# Altium schematic sheet DIOT_Kasli_Adapter.SchDoc
size 420 x 297 mm; DocumentNumber: 1; SheetNumber: 1; SheetTotal: 8; EDA_Number: ARTIQ; ModifiedBy: -; Title2: -; DivGrp: ISE; ModifiedDate: -
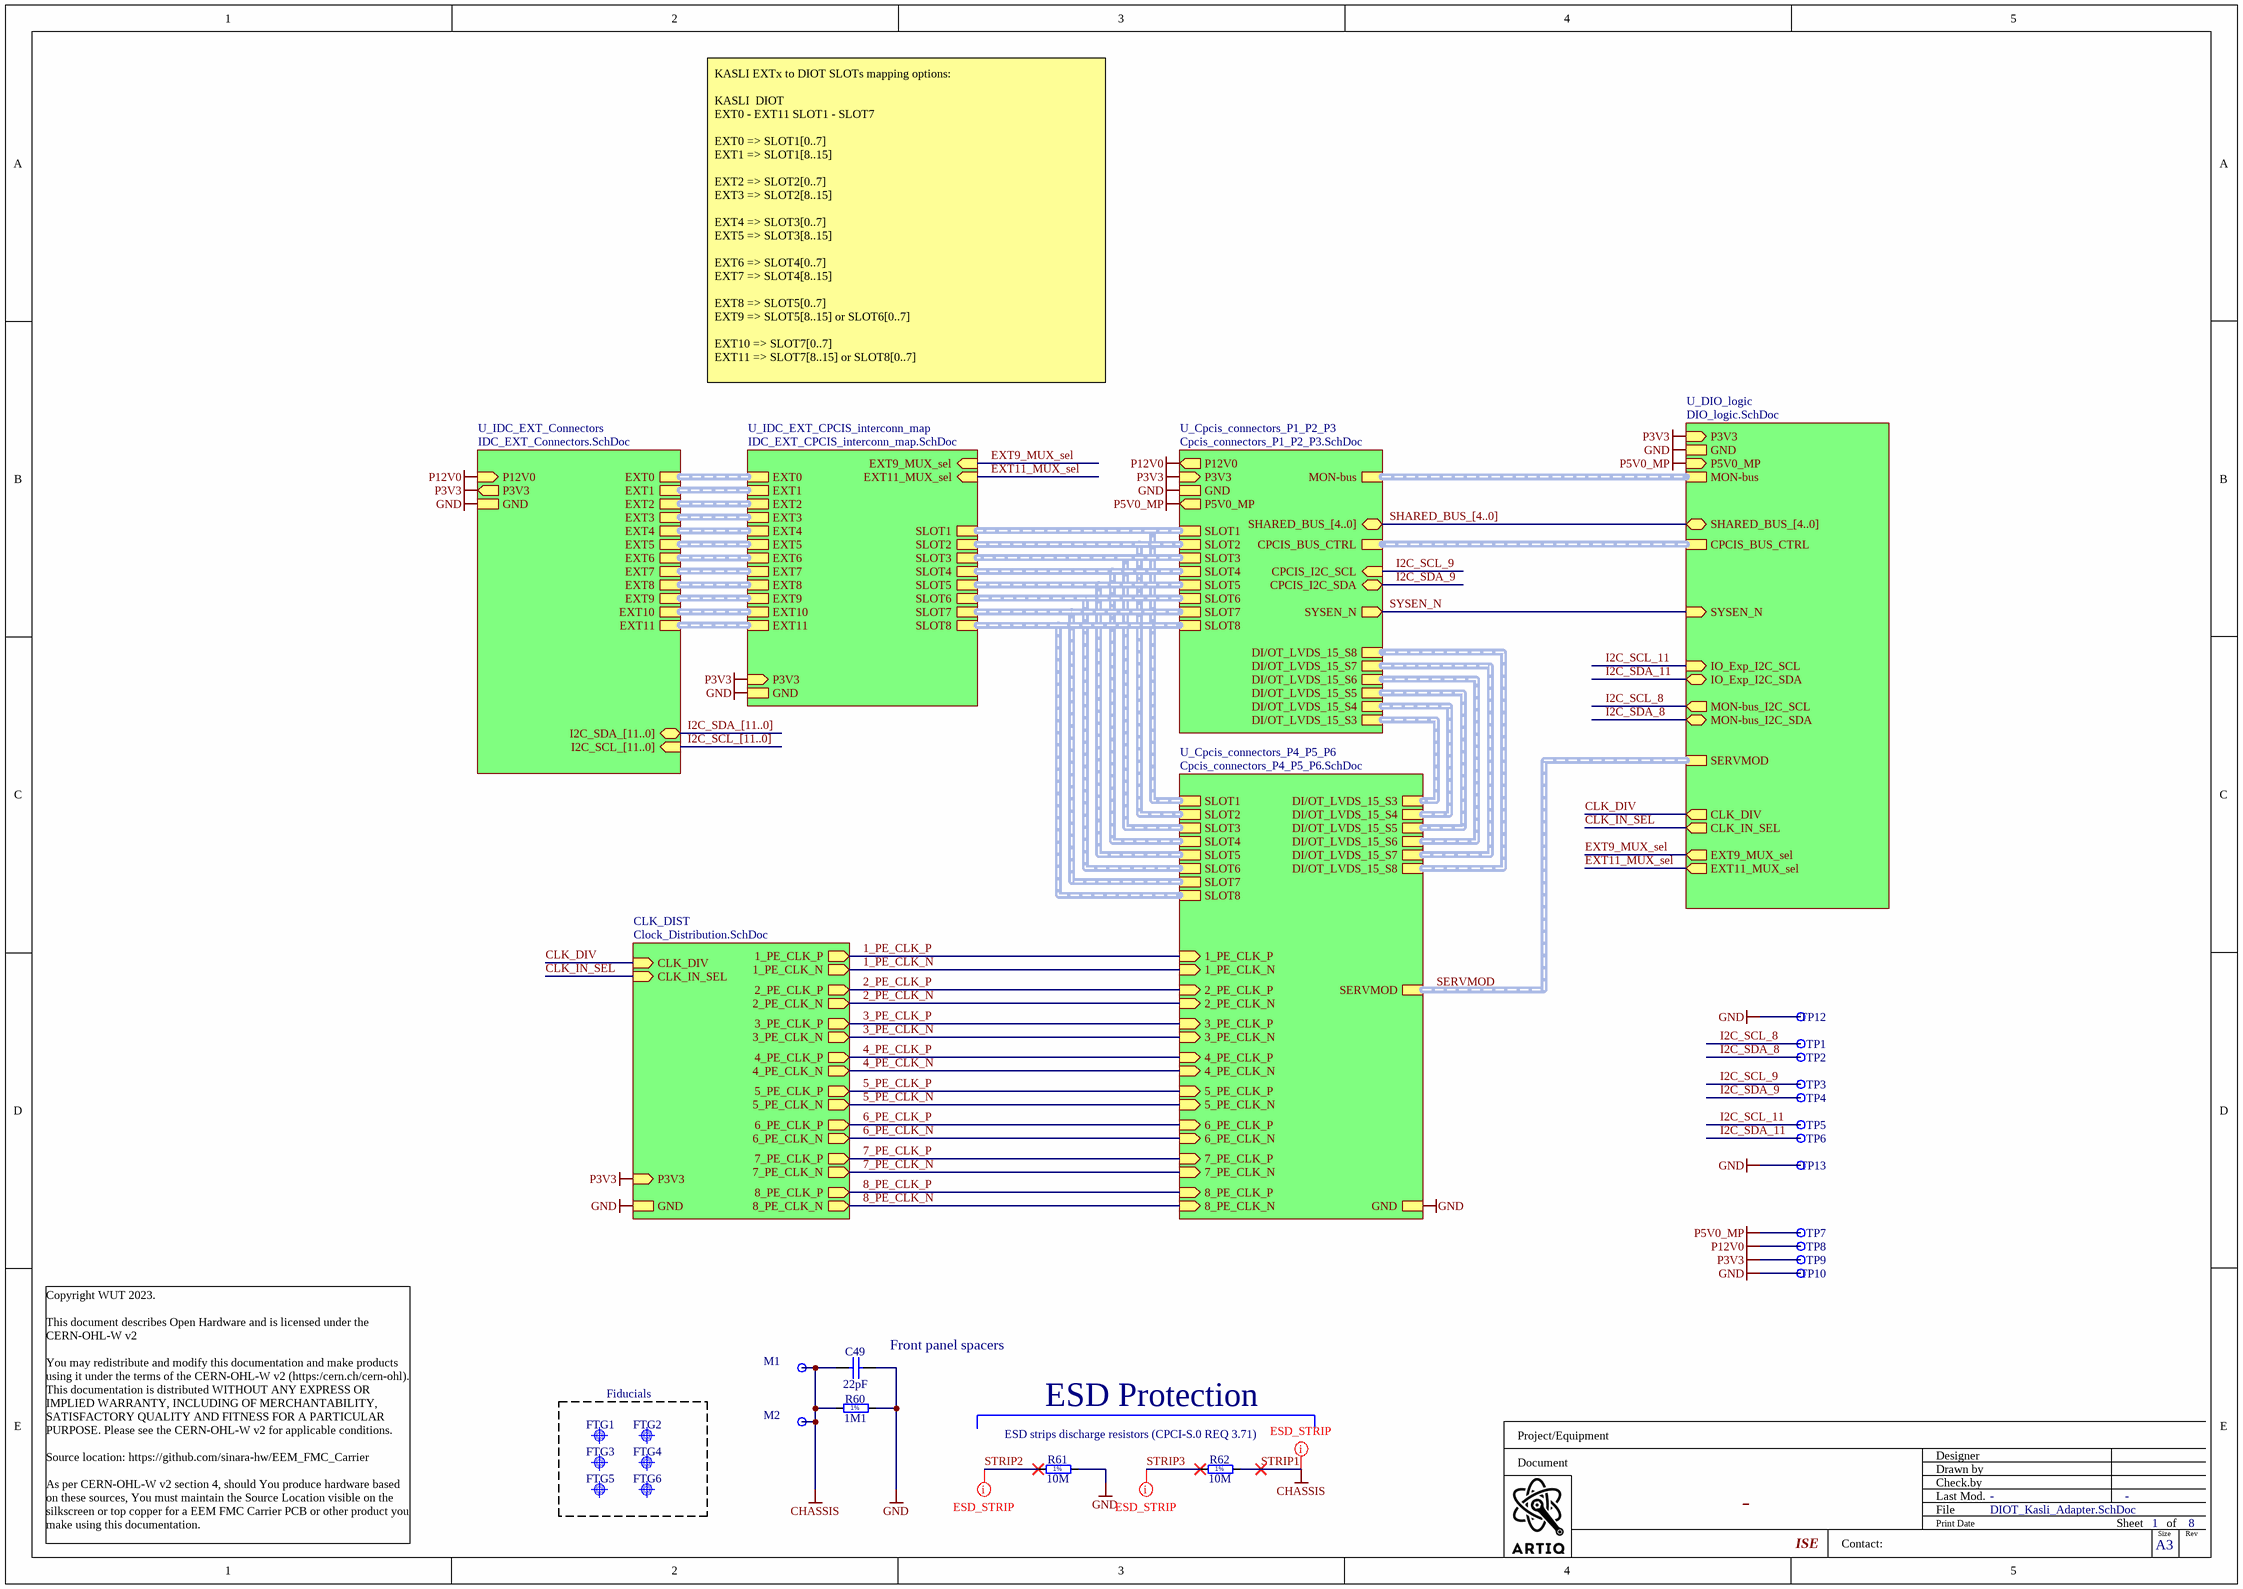
[diagram p0: DIOT_Kasli_Adapter.SchDoc]

## Parts
C49  22pF  [CAPC1005X55N]
FTG1  Use only in PCB  [FIDUCIAL_TOP_S100-200]  (value not drawn)  (no BOM)
FTG2  Use only in PCB  [FIDUCIAL_TOP_S100-200]  (value not drawn)  (no BOM)
FTG3  Use only in PCB  [FIDUCIAL_TOP_S100-200]  (value not drawn)  (no BOM)
FTG4  Use only in PCB  [FIDUCIAL_TOP_S100-200]  (value not drawn)  (no BOM)
FTG5  Use only in PCB  [FIDUCIAL_TOP_S100-200]  (value not drawn)  (no BOM)
FTG6  Use only in PCB  [FIDUCIAL_TOP_S100-200]  (value not drawn)  (no BOM)
M1  Plated Hole  [MTG300_600]  (value not drawn)  (no BOM)
M2  Plated Hole  [MTG300_600]  (value not drawn)  (no BOM)
R60  1M1  [RESC2012X60N]
R61  10M  [RESC2113X55N]
R62  10M  [RESC2113X55N]
TP1  P3V3  [TPS127]  (value not drawn)  (no BOM)
TP2  P3V3  [TPS127]  (value not drawn)  (no BOM)
TP3  P3V3  [TPS127]  (value not drawn)  (no BOM)
TP4  P3V3  [TPS127]  (value not drawn)  (no BOM)
TP5  P3V3  [TPS127]  (value not drawn)  (no BOM)
TP6  P3V3  [TPS127]  (value not drawn)  (no BOM)
TP7  P3V3  [TPS127]  (value not drawn)  (no BOM)
TP8  P3V3  [TPS127]  (value not drawn)  (no BOM)
TP9  P3V3  [TPS127]  (value not drawn)  (no BOM)
TP10  P3V3  [TPS127]  (value not drawn)  (no BOM)
TP12  P3V3  [TPS127]  (value not drawn)  (no BOM)
TP13  P3V3  [TPS127]  (value not drawn)  (no BOM)

## Blocks framed on the sheet
Fiducials: FTG1-FTG6

## Sub-sheets
CLK_DIST = Clock_Distribution.SchDoc: 1_PE_CLK_P (out), 1_PE_CLK_N (out), 2_PE_CLK_P (out), 2_PE_CLK_N (out), 3_PE_CLK_P (out), 3_PE_CLK_N (out), 4_PE_CLK_P (out), 4_PE_CLK_N (out), 5_PE_CLK_P (out), 5_PE_CLK_N (out), 6_PE_CLK_P (out), 6_PE_CLK_N (out), 7_PE_CLK_P (out), 7_PE_CLK_N (out), 8_PE_CLK_P (out), 8_PE_CLK_N (out), CLK_DIV (in), CLK_IN_SEL (in), P3V3 (in), GND
U_Cpcis_connectors_P1_P2_P3 = Cpcis_connectors_P1_P2_P3.SchDoc: CPCIS_I2C_SCL (in), CPCIS_I2C_SDA (bidir), SLOT7 (harness SLOT), SLOT6 (harness ExtensionConnector), SLOT1 (harness SLOT), SLOT5 (harness SLOT), SLOT2 (harness SLOT), SLOT3 (harness SLOT), SLOT4 (harness SLOT), SLOT8 (harness ExtensionConnector), DI/OT_LVDS_15_S3 (harness LVDS), DI/OT_LVDS_15_S4 (harness LVDS), DI/OT_LVDS_15_S5 (harness LVDS), DI/OT_LVDS_15_S6 (harness LVDS), DI/OT_LVDS_15_S7 (harness LVDS), DI/OT_LVDS_15_S8 (harness LVDS), SHARED_BUS_[4..0] (bidir), GND, P12V0 (out), CPCIS_BUS_CTRL (harness CPCIS_BUS_CTRL), P3V3 (in), SYSEN_N (out), MON-bus (harness MON-bus), P5V0_MP (out)
U_Cpcis_connectors_P4_P5_P6 = Cpcis_connectors_P4_P5_P6.SchDoc: 1_PE_CLK_P (in), 1_PE_CLK_N (in), 2_PE_CLK_P (in), 2_PE_CLK_N (in), 3_PE_CLK_P (in), 3_PE_CLK_N (in), 4_PE_CLK_P (in), 4_PE_CLK_N (in), 5_PE_CLK_P (in), 5_PE_CLK_N (in), 6_PE_CLK_P (in), 6_PE_CLK_N (in), 7_PE_CLK_P (in), 7_PE_CLK_N (in), 8_PE_CLK_P (in), 8_PE_CLK_N (in), SLOT8 (harness ExtensionConnector), SLOT5 (harness SLOT), SLOT1 (harness SLOT), SLOT3 (harness SLOT), SLOT6 (harness ExtensionConnector), SLOT2 (harness SLOT), SLOT7 (harness SLOT), SLOT4 (harness SLOT), DI/OT_LVDS_15_S3 (harness LVDS), DI/OT_LVDS_15_S4 (harness LVDS), DI/OT_LVDS_15_S5 (harness LVDS), DI/OT_LVDS_15_S6 (harness LVDS), DI/OT_LVDS_15_S7 (harness LVDS), DI/OT_LVDS_15_S8 (harness LVDS), SERVMOD (harness SERVMOD), GND
U_DIO_logic = DIO_logic.SchDoc: CPCIS_BUS_CTRL (harness CPCIS_BUS_CTRL), MON-bus (harness MON-bus), GND, P3V3 (in), SYSEN_N (in), SERVMOD (harness SERVMOD), SHARED_BUS_[4..0] (bidir), IO_Exp_I2C_SCL (in), IO_Exp_I2C_SDA (bidir), P5V0_MP (in), MON-bus_I2C_SCL (out), MON-bus_I2C_SDA (bidir), CLK_DIV (out), CLK_IN_SEL (out), EXT9_MUX_sel (out), EXT11_MUX_sel (out)
U_IDC_EXT_Connectors = IDC_EXT_Connectors.SchDoc: EXT0 (harness ExtensionConnector), EXT2 (harness ExtensionConnector), EXT4 (harness ExtensionConnector), EXT5 (harness ExtensionConnector), EXT6 (harness ExtensionConnector), EXT7 (harness ExtensionConnector), I2C_SDA_[11..0] (bidir), I2C_SCL_[11..0] (in), EXT3 (harness ExtensionConnector), EXT1 (harness ExtensionConnector), EXT8 (harness ExtensionConnector), EXT9 (harness ExtensionConnector), EXT10 (harness ExtensionConnector), EXT11 (harness ExtensionConnector), GND, P3V3 (out), P12V0 (in)
U_IDC_EXT_CPCIS_interconn_map = IDC_EXT_CPCIS_interconn_map.SchDoc: EXT0 (harness ExtensionConnector), EXT2 (harness ExtensionConnector), EXT4 (harness ExtensionConnector), EXT5 (harness ExtensionConnector), EXT6 (harness ExtensionConnector), EXT7 (harness ExtensionConnector), EXT3 (harness ExtensionConnector), EXT1 (harness ExtensionConnector), EXT8 (harness ExtensionConnector), EXT9 (harness ExtensionConnector), EXT10 (harness ExtensionConnector), EXT11 (harness ExtensionConnector), SLOT2 (harness SLOT), SLOT3 (harness SLOT), SLOT1 (harness SLOT), SLOT4 (harness SLOT), SLOT5 (harness SLOT), SLOT6 (harness ExtensionConnector), SLOT8 (harness ExtensionConnector), SLOT7 (harness SLOT), GND, P3V3 (in), EXT9_MUX_sel (in), EXT11_MUX_sel (in)

## Nets
GND: C49.2 R60.2 R61.2 TP10.1 TP12.1 TP13.1 ; sheet U_Cpcis_connectors_P1_P2_P3/GND, sheet U_Cpcis_connectors_P4_P5_P6/GND, sheet U_IDC_EXT_Connectors/GND, sheet CLK_DIST/GND, sheet U_IDC_EXT_CPCIS_interconn_map/GND, sheet U_DIO_logic/GND
P3V3: TP9.1 ; sheet U_Cpcis_connectors_P1_P2_P3/P3V3, sheet U_IDC_EXT_Connectors/P3V3, sheet CLK_DIST/P3V3, sheet U_IDC_EXT_CPCIS_interconn_map/P3V3, sheet U_DIO_logic/P3V3
P5V0_MP: TP7.1 ; sheet U_Cpcis_connectors_P1_P2_P3/P5V0_MP, sheet U_DIO_logic/P5V0_MP
P12V0: TP8.1 ; sheet U_Cpcis_connectors_P1_P2_P3/P12V0, sheet U_IDC_EXT_Connectors/P12V0
STRIP1: C49.1 M1.1 M2.1 R60.1 R62.2  [also labelled CHASSIS]
1_PE_CLK_N: sheet U_Cpcis_connectors_P4_P5_P6/1_PE_CLK_N, sheet CLK_DIST/1_PE_CLK_N
1_PE_CLK_P: sheet U_Cpcis_connectors_P4_P5_P6/1_PE_CLK_P, sheet CLK_DIST/1_PE_CLK_P
2_PE_CLK_N: sheet U_Cpcis_connectors_P4_P5_P6/2_PE_CLK_N, sheet CLK_DIST/2_PE_CLK_N
2_PE_CLK_P: sheet U_Cpcis_connectors_P4_P5_P6/2_PE_CLK_P, sheet CLK_DIST/2_PE_CLK_P
3_PE_CLK_N: sheet U_Cpcis_connectors_P4_P5_P6/3_PE_CLK_N, sheet CLK_DIST/3_PE_CLK_N
3_PE_CLK_P: sheet U_Cpcis_connectors_P4_P5_P6/3_PE_CLK_P, sheet CLK_DIST/3_PE_CLK_P
4_PE_CLK_N: sheet U_Cpcis_connectors_P4_P5_P6/4_PE_CLK_N, sheet CLK_DIST/4_PE_CLK_N
4_PE_CLK_P: sheet U_Cpcis_connectors_P4_P5_P6/4_PE_CLK_P, sheet CLK_DIST/4_PE_CLK_P
5_PE_CLK_N: sheet U_Cpcis_connectors_P4_P5_P6/5_PE_CLK_N, sheet CLK_DIST/5_PE_CLK_N
5_PE_CLK_P: sheet U_Cpcis_connectors_P4_P5_P6/5_PE_CLK_P, sheet CLK_DIST/5_PE_CLK_P
6_PE_CLK_N: sheet U_Cpcis_connectors_P4_P5_P6/6_PE_CLK_N, sheet CLK_DIST/6_PE_CLK_N
6_PE_CLK_P: sheet U_Cpcis_connectors_P4_P5_P6/6_PE_CLK_P, sheet CLK_DIST/6_PE_CLK_P
7_PE_CLK_N: sheet U_Cpcis_connectors_P4_P5_P6/7_PE_CLK_N, sheet CLK_DIST/7_PE_CLK_N
7_PE_CLK_P: sheet U_Cpcis_connectors_P4_P5_P6/7_PE_CLK_P, sheet CLK_DIST/7_PE_CLK_P
8_PE_CLK_N: sheet U_Cpcis_connectors_P4_P5_P6/8_PE_CLK_N, sheet CLK_DIST/8_PE_CLK_N
8_PE_CLK_P: sheet U_Cpcis_connectors_P4_P5_P6/8_PE_CLK_P, sheet CLK_DIST/8_PE_CLK_P
CLK_DIV: sheet CLK_DIST/CLK_DIV, sheet U_DIO_logic/CLK_DIV
CLK_IN_SEL: sheet CLK_DIST/CLK_IN_SEL, sheet U_DIO_logic/CLK_IN_SEL
EXT9_MUX_sel: sheet U_IDC_EXT_CPCIS_interconn_map/EXT9_MUX_sel, sheet U_DIO_logic/EXT9_MUX_sel
EXT11_MUX_sel: sheet U_IDC_EXT_CPCIS_interconn_map/EXT11_MUX_sel, sheet U_DIO_logic/EXT11_MUX_sel
I2C_SCL_8: TP1.1 ; sheet U_DIO_logic/MON-bus_I2C_SCL
I2C_SCL_9: TP3.1 ; sheet U_Cpcis_connectors_P1_P2_P3/CPCIS_I2C_SCL
I2C_SCL_11: TP5.1 ; sheet U_DIO_logic/IO_Exp_I2C_SCL
I2C_SDA_8: TP2.1 ; sheet U_DIO_logic/MON-bus_I2C_SDA
I2C_SDA_9: TP4.1 ; sheet U_Cpcis_connectors_P1_P2_P3/CPCIS_I2C_SDA
I2C_SDA_11: TP6.1 ; sheet U_DIO_logic/IO_Exp_I2C_SDA
STRIP2: R61.1
STRIP3: R62.1
SYSEN_N: sheet U_Cpcis_connectors_P1_P2_P3/SYSEN_N, sheet U_DIO_logic/SYSEN_N

## Buses and harness runs
bus I2C_SCL_[11..0] = sheet U_IDC_EXT_Connectors/I2C_SCL_[11..0]
bus I2C_SDA_[11..0] = sheet U_IDC_EXT_Connectors/I2C_SDA_[11..0]
bus SHARED_BUS_[4..0] = sheet U_Cpcis_connectors_P1_P2_P3/SHARED_BUS_[4..0] = sheet U_DIO_logic/SHARED_BUS_[4..0]
harness SERVMOD = sheet U_Cpcis_connectors_P4_P5_P6/SERVMOD = sheet U_DIO_logic/SERVMOD
harness sheet U_Cpcis_connectors_P1_P2_P3/CPCIS_BUS_CTRL = sheet U_DIO_logic/CPCIS_BUS_CTRL
harness sheet U_Cpcis_connectors_P1_P2_P3/DI/OT_LVDS_15_S3 = sheet U_Cpcis_connectors_P4_P5_P6/DI/OT_LVDS_15_S3
harness sheet U_Cpcis_connectors_P1_P2_P3/DI/OT_LVDS_15_S4 = sheet U_Cpcis_connectors_P4_P5_P6/DI/OT_LVDS_15_S4
harness sheet U_Cpcis_connectors_P1_P2_P3/DI/OT_LVDS_15_S5 = sheet U_Cpcis_connectors_P4_P5_P6/DI/OT_LVDS_15_S5
harness sheet U_Cpcis_connectors_P1_P2_P3/DI/OT_LVDS_15_S6 = sheet U_Cpcis_connectors_P4_P5_P6/DI/OT_LVDS_15_S6
harness sheet U_Cpcis_connectors_P1_P2_P3/DI/OT_LVDS_15_S7 = sheet U_Cpcis_connectors_P4_P5_P6/DI/OT_LVDS_15_S7
harness sheet U_Cpcis_connectors_P1_P2_P3/DI/OT_LVDS_15_S8 = sheet U_Cpcis_connectors_P4_P5_P6/DI/OT_LVDS_15_S8
harness sheet U_Cpcis_connectors_P1_P2_P3/MON-bus = sheet U_DIO_logic/MON-bus
harness sheet U_Cpcis_connectors_P1_P2_P3/SLOT1 = sheet U_Cpcis_connectors_P4_P5_P6/SLOT1 = sheet U_IDC_EXT_CPCIS_interconn_map/SLOT1
harness sheet U_Cpcis_connectors_P1_P2_P3/SLOT2 = sheet U_Cpcis_connectors_P4_P5_P6/SLOT2 = sheet U_IDC_EXT_CPCIS_interconn_map/SLOT2
harness sheet U_Cpcis_connectors_P1_P2_P3/SLOT3 = sheet U_Cpcis_connectors_P4_P5_P6/SLOT3 = sheet U_IDC_EXT_CPCIS_interconn_map/SLOT3
harness sheet U_Cpcis_connectors_P1_P2_P3/SLOT4 = sheet U_Cpcis_connectors_P4_P5_P6/SLOT4 = sheet U_IDC_EXT_CPCIS_interconn_map/SLOT4
harness sheet U_Cpcis_connectors_P1_P2_P3/SLOT5 = sheet U_Cpcis_connectors_P4_P5_P6/SLOT5 = sheet U_IDC_EXT_CPCIS_interconn_map/SLOT5
harness sheet U_Cpcis_connectors_P1_P2_P3/SLOT6 = sheet U_Cpcis_connectors_P4_P5_P6/SLOT6 = sheet U_IDC_EXT_CPCIS_interconn_map/SLOT6
harness sheet U_Cpcis_connectors_P1_P2_P3/SLOT7 = sheet U_Cpcis_connectors_P4_P5_P6/SLOT7 = sheet U_IDC_EXT_CPCIS_interconn_map/SLOT7
harness sheet U_Cpcis_connectors_P1_P2_P3/SLOT8 = sheet U_Cpcis_connectors_P4_P5_P6/SLOT8 = sheet U_IDC_EXT_CPCIS_interconn_map/SLOT8
harness sheet U_IDC_EXT_Connectors/EXT0 = sheet U_IDC_EXT_CPCIS_interconn_map/EXT0
harness sheet U_IDC_EXT_Connectors/EXT1 = sheet U_IDC_EXT_CPCIS_interconn_map/EXT1
harness sheet U_IDC_EXT_Connectors/EXT2 = sheet U_IDC_EXT_CPCIS_interconn_map/EXT2
harness sheet U_IDC_EXT_Connectors/EXT3 = sheet U_IDC_EXT_CPCIS_interconn_map/EXT3
harness sheet U_IDC_EXT_Connectors/EXT4 = sheet U_IDC_EXT_CPCIS_interconn_map/EXT4
harness sheet U_IDC_EXT_Connectors/EXT5 = sheet U_IDC_EXT_CPCIS_interconn_map/EXT5
harness sheet U_IDC_EXT_Connectors/EXT6 = sheet U_IDC_EXT_CPCIS_interconn_map/EXT6
harness sheet U_IDC_EXT_Connectors/EXT7 = sheet U_IDC_EXT_CPCIS_interconn_map/EXT7
harness sheet U_IDC_EXT_Connectors/EXT8 = sheet U_IDC_EXT_CPCIS_interconn_map/EXT8
harness sheet U_IDC_EXT_Connectors/EXT9 = sheet U_IDC_EXT_CPCIS_interconn_map/EXT9
harness sheet U_IDC_EXT_Connectors/EXT10 = sheet U_IDC_EXT_CPCIS_interconn_map/EXT10
harness sheet U_IDC_EXT_Connectors/EXT11 = sheet U_IDC_EXT_CPCIS_interconn_map/EXT11

## Layout directives
net class ESD_STRIP: STRIP1, STRIP2, STRIP3

## Notes on the sheet
- KASLI EXTx to DIOT SLOTs mapping options:
  KASLI		DIOT
  EXT0 - EXT11	SLOT1 - SLOT7
  EXT0	=>	SLOT1[0..7]
  EXT1	=>	SLOT1[8..15]
  EXT2	=>	SLOT2[0..7]
  EXT3	=>	SLOT2[8..15]
  EXT4	=>	SLOT3[0..7]
  EXT5	=>	SLOT3[8..15]
  EXT6	=>	SLOT4[0..7]
  EXT7	=>	SLOT4[8..15]
  EXT8	=>	SLOT5[0..7]
  EXT9	=>	SLOT5[8..15]	or	SLOT6[0..7]
  EXT10	=>	SLOT7[0..7]
  EXT11	=>	SLOT7[8..15]	or	SLOT8[0..7]
- (near C49) Front panel spacers
- ESD strips discharge resistors (CPCI-S.0 REQ 3.71)
- ESD Protection
- Project/Equipment
- Document
- Designer
- Drawn by
- Check.by
- Copyright WUT 2023.
  This document describes Open Hardware and is licensed under the CERN-OHL-W v2
  You may redistribute and modify this documentation and make products using it under the terms of the CERN-OHL-W v2 (https:/cern.ch/cern-ohl). This documentation is distributed WITHOUT ANY EXPRESS OR IMPLIED WARRANTY, INCLUDING OF MERCHANTABILITY, SATISFACTORY QUALITY AND FITNESS FOR A PARTICULAR PURPOSE. Please see the CERN-OHL-W v2 for applicable conditions.
  Source location: https://github.com/sinara-hw/EEM_FMC_Carrier
  As per CERN-OHL-W v2 section 4, should You produce hardware based on these sources, You must maintain the Source Location visible on the silkscreen or top copper for a EEM FMC Carrier PCB or other product you make using this documentation.
- Contact:
- File
- Last Mod.
- Print Date
- Sheet
- Size
- A3
- of
- Rev
- (in symbol R0805_1M1_1%_0.125W_100PPM) 1%
- (in symbol R0805_10M_1%_0.125W_100PPM_VISHAY_CRCW e3) 1%

## Library data of the parts
C49 = CC0402_22PF_50V_5%_C0G: Non-polarised capacitor; Part Description: SMD Multilayer Chip Ceramic Capacitor; Manufacturer: GENERIC; Manufacturer1 Part Number: C0402C220J5GACTU; Voltage: 50V; TC: C0G/NP0; Tolerance: ±5%; Part Number: CC0402_22PF_50V_5%_C0G; Component Kind: Standard; Component Type: Standard; Pin Count: 2; Value: 22pF; Status: Preferred; Manufacturer Part Number: CC0402_22PF_50V_5%_C0G; Case: 0402; Mounted: Yes; Socket: No; SMD: Yes; Manufacturer1 Example: KEMET; Manufacturer1 ComponentHeight: 0.55mm; HelpURL: \\cern.ch\dfs\Applications\Altium\Datasheets\CC0402_C0G_KEMET_(Commercial Grade).pdf; Author: CERN DEM JLC; CreateDate: 2007-12-03; LatestRevisionDate: 2007-12-03; Sense: No
FTG1-FTG6 = FIDUCIAL_TARGET_S100-200: Fiducial Target; Part Description: Square Fiducial Target, Top Layer, 1.0mm, Top Solder 2.0mm, Keepout =2.0mm; Mounted: No; Part Number: FIDUCIAL_TARGET_S100-200; Component Type: Standard (No BOM); Pin Count: 1; Family: Fiducial; Socket: No; SMD: Yes; Status: None; ComponentHeight: 0mm; Author: CERN DEM JLC; CreateDate: 2010-02-09; LatestRevisionDate: 2012-04-04; PackageDescription: Square Fiducial Target, Top Layer, 1.0mm, Top Solder 2.0mm, Keepout =2.0mm; HelpURL: Undefined; Sense: No
M1 M2 = PLATED_HOLE3.0_PAD6.0: Single Terminal Socket; Part Description: Plated Through Hole: Hole Dia.=3.0mm Pad Dia.=6.0mm; Mounted: No; Table: Pads; Part Number: PLATED_HOLE3.0_PAD6.0; Component Type: Standard (No BOM); Designator: Single Terminal Socket; Library Reference: Single Terminal Socket; Pin Count: 1; Family: Plated Hole; Socket: No; SMD: No; Status: None; ComponentHeight: 0mm; Author: CERN DEM JLC; CreateDate: 26.05.2008; LatestRevisionDate: 26.05.2008; PackageDescription: Plated Through Hole: Hole Dia.=3.0mm Pad Dia.=6.0mm
R60 = R0805_1M1_1%_0.125W_100PPM: Resistor - 1%; Part Description: General Purpose Thick Film Chip Resistor; Manufacturer: GENERIC; Manufacturer1 Part Number: NRC10F1104TRF; Power: 0.125W; TC: ±100ppm/°C; PressFit: No; Part Number: R0805_1M1_1%_0.125W_100PPM; Component Kind: Standard; Component Type: Standard; Pin Count: 2; Value: 1M1; Status: Preferred; Tolerance: ±1%; Manufacturer Part Number: R0805_1M1_1%_0.125W_100PPM; Case: 0805; Mounted: Yes; Sense: No; Socket: No; SMD: Yes; Manufacturer1 Example: NIC COMPONENT; Manufacturer1 ComponentHeight: 0.6mm; HelpURL: \\cern.ch\dfs\Applications\Altium\Datasheets\R0805_NIC_NRC.pdf; Author: CERN DEM JLC; CreateDate: 03/12/2007; LatestRevisionDate: 13/03/2008
R61 R62 = R0805_10M_1%_0.125W_100PPM_VISHAY_CRCW e3: Resistor - 1%; Part Description: 150V, Standard Thick Film Chip Resistor; Manufacturer: VISHAY DALE; Manufacturer Part Number: CRCW080510M0FKEA; Power: 0.125W; TC: ±100ppm/°C; PressFit: No; Part Number: R0805_10M_1%_0.125W_100PPM_VISHAY_CRCW e3; Component Kind: Standard; Component Type: Standard; Pin Count: 2; Value: 10M; Status: None; Tolerance: ±1%; Case: 0805; Mounted: Yes; Sense: No; Socket: No; SMD: Yes; ComponentHeight: 0.5mm; HelpURL: \\cern.ch\dfs\Applications\Altium\Datasheets\R0805_VISHAY_CRCW e3.pdf; Author: CERN DEM BC; CreateDate: 2019-11-12; LatestRevisionDate: 2019-11-12
TP1-TP10 TP12 TP13 = SMD_PAD_1.27X1.27MM: Test Point; Part Description: 1.27mm x 1.27mm PCB Copper Area (SMD Test Point); Mounted: No; Part Number: SMD_PAD_1.27X1.27MM; Component Type: Standard (No BOM); Pin Count: 1; Family: Test Point; Socket: No; SMD: Yes; Sense: No; Status: None; ComponentHeight: 0mm; HelpURL: Undefined; Author: CERN DEM JLC; CreateDate: 12.01.2008; LatestRevisionDate: 12.01.2008; PackageDescription: 1.27mm x 1.27mm PCB Copper Area (SMD Test Point)